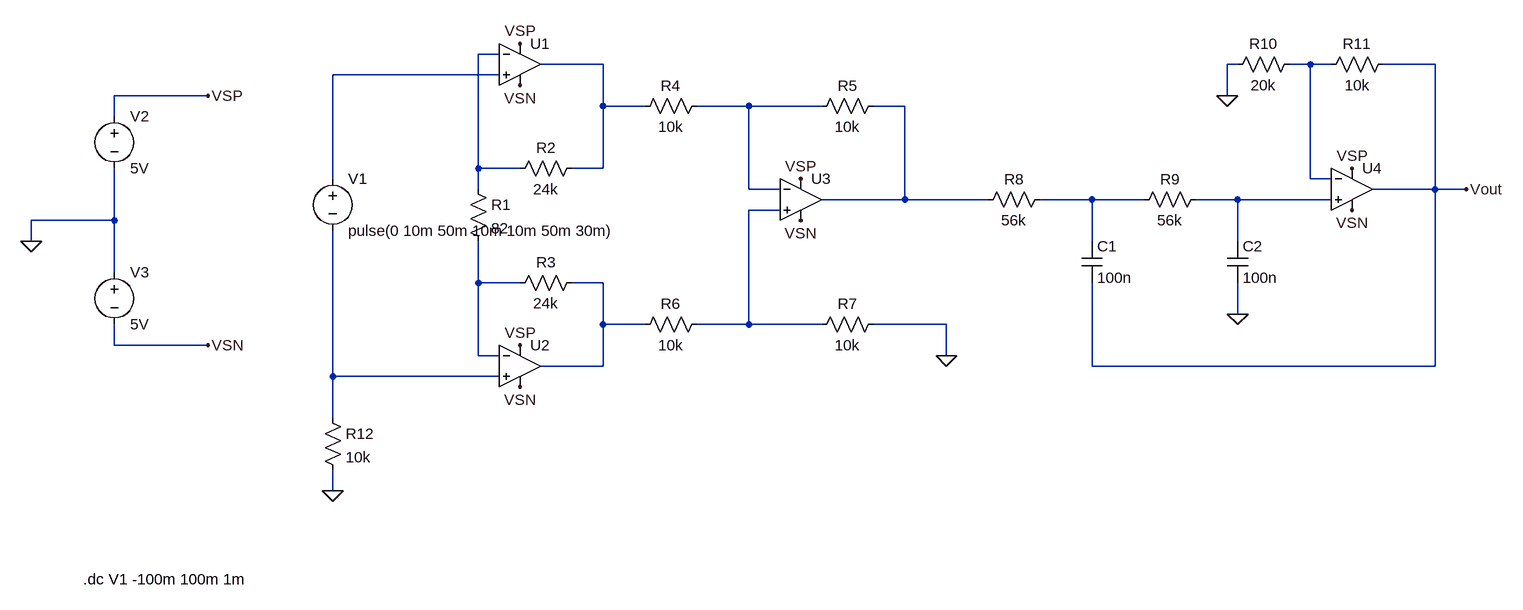
[diagram p0: schematic circuit_5.1.asc]
circuit_5.1.asc, the LTspice schematic file:
Version 4
SHEET 1 2244 896
WIRE 688 -144 656 -144
WIRE 848 -128 752 -128
WIRE 1824 -128 1808 -128
WIRE 1936 -128 1904 -128
WIRE 1968 -128 1936 -128
WIRE 2128 -128 2048 -128
WIRE 688 -112 432 -112
WIRE 240 -80 96 -80
WIRE 1808 -80 1808 -128
WIRE 848 -64 848 -128
WIRE 912 -64 848 -64
WIRE 1072 -64 992 -64
WIRE 1184 -64 1072 -64
WIRE 1312 -64 1264 -64
WIRE 96 -48 96 -80
WIRE 656 32 656 -144
WIRE 720 32 656 32
WIRE 848 32 848 -64
WIRE 848 32 800 32
WIRE 432 48 432 -112
WIRE 1936 48 1936 -128
WIRE 1968 48 1936 48
WIRE 656 64 656 32
WIRE 1072 64 1072 -64
WIRE 1120 64 1072 64
WIRE 2128 64 2128 -128
WIRE 2128 64 2032 64
WIRE 2176 64 2128 64
WIRE 1312 80 1312 -64
WIRE 1312 80 1184 80
WIRE 1440 80 1312 80
WIRE 1600 80 1520 80
WIRE 1680 80 1600 80
WIRE 1824 80 1760 80
WIRE 1968 80 1824 80
WIRE 1120 96 1072 96
WIRE 96 112 96 32
WIRE 96 112 -32 112
WIRE -32 144 -32 112
WIRE 1600 144 1600 80
WIRE 1824 144 1824 80
WIRE 96 192 96 112
WIRE 656 208 656 144
WIRE 720 208 656 208
WIRE 848 208 800 208
WIRE 1824 256 1824 208
WIRE 848 272 848 208
WIRE 912 272 848 272
WIRE 1072 272 1072 96
WIRE 1072 272 992 272
WIRE 1184 272 1072 272
WIRE 1376 272 1264 272
WIRE 96 304 96 272
WIRE 240 304 96 304
WIRE 656 320 656 208
WIRE 688 320 656 320
WIRE 1376 320 1376 272
WIRE 848 336 848 272
WIRE 848 336 752 336
WIRE 1600 336 1600 208
WIRE 2128 336 2128 64
WIRE 2128 336 1600 336
WIRE 432 352 432 128
WIRE 688 352 432 352
WIRE 432 416 432 352
WIRE 432 528 432 496
FLAG -32 144 0
FLAG 240 304 VSN
FLAG 240 -80 VSP
FLAG 720 -160 VSP
FLAG 720 304 VSP
FLAG 720 -96 VSN
FLAG 720 368 VSN
FLAG 1152 112 VSN
FLAG 1152 48 VSP
FLAG 432 528 0
FLAG 1376 320 0
FLAG 1824 256 0
FLAG 2000 96 VSN
FLAG 2000 32 VSP
FLAG 1808 -80 0
FLAG 2176 64 Vout
SYMBOL voltage 96 176 R0
SYMATTR InstName V3
SYMATTR Value 5V
SYMBOL voltage 96 -64 R0
SYMATTR InstName V2
SYMATTR Value 5V
SYMBOL voltage 432 32 R0
WINDOW 123 24 124 Left 2
WINDOW 39 0 0 Left 0
SYMATTR InstName V1
SYMATTR Value pulse(0 10m 50m 10m 10m 50m 30m)
SYMBOL OpAmps\\UniversalOpamp2 720 -128 R0
SYMATTR InstName U1
SYMBOL OpAmps\\UniversalOpamp2 720 336 R0
SYMATTR InstName U2
SYMBOL OpAmps\\UniversalOpamp2 1152 80 R0
SYMATTR InstName U3
SYMBOL res 640 48 R0
SYMATTR InstName R1
SYMATTR Value 82
SYMBOL res 816 16 R90
WINDOW 0 0 56 VBottom 2
WINDOW 3 32 56 VTop 2
SYMATTR InstName R2
SYMATTR Value 24k
SYMBOL res 816 192 R90
WINDOW 0 0 56 VBottom 2
WINDOW 3 32 56 VTop 2
SYMATTR InstName R3
SYMATTR Value 24k
SYMBOL res 416 400 R0
SYMATTR InstName R12
SYMATTR Value 10k
SYMBOL res 1008 -80 R90
WINDOW 0 0 56 VBottom 2
WINDOW 3 32 56 VTop 2
SYMATTR InstName R4
SYMATTR Value 10k
SYMBOL res 1280 -80 R90
WINDOW 0 0 56 VBottom 2
WINDOW 3 32 56 VTop 2
SYMATTR InstName R5
SYMATTR Value 10k
SYMBOL res 1280 256 R90
WINDOW 0 0 56 VBottom 2
WINDOW 3 32 56 VTop 2
SYMATTR InstName R7
SYMATTR Value 10k
SYMBOL res 1008 256 R90
WINDOW 0 0 56 VBottom 2
WINDOW 3 32 56 VTop 2
SYMATTR InstName R6
SYMATTR Value 10k
SYMBOL res 1536 64 R90
WINDOW 0 0 56 VBottom 2
WINDOW 3 32 56 VTop 2
SYMATTR InstName R8
SYMATTR Value 56k
SYMBOL res 1776 64 R90
WINDOW 0 0 56 VBottom 2
WINDOW 3 32 56 VTop 2
SYMATTR InstName R9
SYMATTR Value 56k
SYMBOL cap 1584 144 R0
SYMATTR InstName C1
SYMATTR Value 100n
SYMBOL cap 1808 144 R0
SYMATTR InstName C2
SYMATTR Value 100n
SYMBOL OpAmps\\UniversalOpamp2 2000 64 R0
SYMATTR InstName U4
SYMBOL res 1920 -144 R90
WINDOW 0 0 56 VBottom 2
WINDOW 3 32 56 VTop 2
SYMATTR InstName R10
SYMATTR Value 20k
SYMBOL res 2064 -144 R90
WINDOW 0 0 56 VBottom 2
WINDOW 3 32 56 VTop 2
SYMATTR InstName R11
SYMATTR Value 10k
TEXT 48 664 Left 2 !.dc V1 -100m 100m 1m

The netlist it stands for:
* circuit_5.1.asc
V3 0 VSN 5V
V2 VSP 0 5V
V1 N004 N012 pulse(0 10m 50m 10m 10m 50m 30m)
XU1 N004 N001 VSP VSN N002 level.2 Avol=1Meg GBW=10Meg Slew=10Meg ilimit=25m rail=0 Vos=0 phimargin=45 en=0 enk=0 in=0 ink=0 Rin=500Meg  ; pins IN+ IN- V+ V- OUT
XU2 N012 N010 VSP VSN N011 level.2 Avol=1Meg GBW=10Meg Slew=10Meg ilimit=25m rail=0 Vos=0 phimargin=45 en=0 enk=0 in=0 ink=0 Rin=500Meg  ; pins IN+ IN- V+ V- OUT
XU3 N009 N005 VSP VSN N006 level.2 Avol=1Meg GBW=10Meg Slew=10Meg ilimit=25m rail=0 Vos=0 phimargin=45 en=0 enk=0 in=0 ink=0 Rin=500Meg  ; pins IN+ IN- V+ V- OUT
R1 N001 N010 82
R2 N002 N001 24k
R3 N011 N010 24k
R12 N012 0 10k
R4 N005 N002 10k
R5 N006 N005 10k
R7 0 N009 10k
R6 N009 N011 10k
R8 N007 N006 56k
R9 N008 N007 56k
C1 N007 Vout 100n
C2 N008 0 100n
XU4 N008 N003 VSP VSN Vout level.2 Avol=1Meg GBW=10Meg Slew=10Meg ilimit=25m rail=0 Vos=0 phimargin=45 en=0 enk=0 in=0 ink=0 Rin=500Meg  ; pins IN+ IN- V+ V- OUT
R10 N003 0 20k
R11 Vout N003 10k
.dc V1 -100m 100m 1m
.lib UniversalOpamps2.sub
.backanno
.end